# EAGLE design rfm69_carrier_leftside (EAGLE 7.1.0)
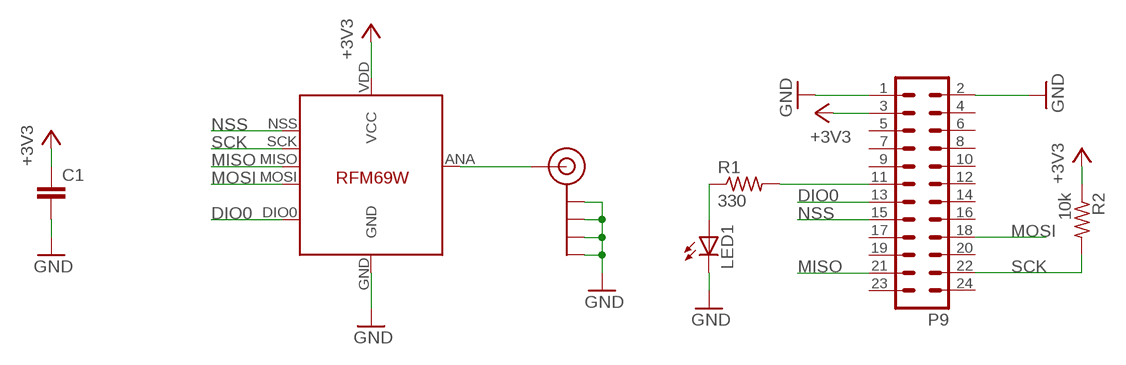
[diagram p0: schematic, sheet 1]

## Parts
ANT  SMA_EDGE  [SMA-EDGE]
C1  C-EUC1206  [C1206]
LED1  LEDCHIP-LED0805  [CHIP-LED0805]
P9  MA12-2W  [MA12-2W]
R1  330  R-US_R0603  [R0603]
R2  10k  R-US_R0603  [R0603]
U1  RFM69  [RFM69W-MINPADS]

## Nets
+3V3: C1.1 P9.3 R2.1 U1.VDD(VCC)
DIO0: P9.13 U1.DIO0
GND: ANT.GND@0(GND) ANT.GND@1(GND) ANT.GND@2(GND) ANT.GND@3(GND) C1.2 LED1.C P9.1 P9.2 U1.GND
MISO: P9.21 U1.MISO
MOSI: P9.18 U1.MOSI
N$1: ANT.SIG(SIGNAL) U1.ANA(ANT)
N$2: P9.11 R1.2
N$8: LED1.A R1.1
NSS: P9.15 U1.NSS(SEL)
SCK: P9.22 R2.2 U1.SCK
Unconnected: P9.4 P9.5 P9.6 P9.7 P9.8 P9.9 P9.10 P9.12 P9.14 P9.16 P9.17 P9.19 P9.20 P9.23 P9.24

## Library data of the parts
ANT = SparkFun-Connectors:SMA_EDGE: SMA Antenna Connector End launch SMA connector. The paste layer has been removed so that the connector can be hand soldered onto the board after reflow.
C1 = rcl:C-EU: CAPACITOR, European symbol
LED1 = led:LED: LED OSRAM: - CHIPLED LG R971, LG N971, LY N971, LG Q971, LY Q971, LO R971, LY R971 LH N974, LH R974 LS Q976, LO Q976, LY Q976 LO Q996 - Hyper CHIPLED LW Q18S LB Q993, LB Q99A, LB R99A - SideLED LS A670, LO A670, LY A670, LG A670, LP A670 LB A673, LV A673, LT A673, LW A673 LH A674 LY A675 LS A676, LA A676, LO A676, LY A676, LW A676 LS A679, LY A679, LG A679 - Hyper Micro SIDELED® LS Y876, LA Y876, LO Y876, LY Y876 LT Y87S - SmartLED LW L88C, LW L88S LB L89C, LB L89S, LG L890 LS L89K, LO L89K, LY L89K LS L896, LA L896, LO L896, LY L896 - TOPLED LS T670, LO T670, LY T670, LG T670, LP T670 LSG T670, LSP T670, LSY T670, LOP T670, LYG T670 LG T671, LOG T671, LSG T671 LB T673, LV T673, LT T673, LW T673 LH T674 LS T676, LA T676, LO T676, LY T676, LB T676, LH T676, LSB T676, LW T676 LB T67C, LV T67C, LT T67C, LS T67K, LO T67K, LY T67K, LW E67C LS E67B, LA E67B, LO E67B, LY E67B, LB E67C, LV E67C, LT E67C LW T67C LS T679, LY T679, LG T679 LS T770, LO T770, LY T770, LG T770, LP T770 LB T773, LV T773, LT T773, LW T773 LH T774 LS E675, LA E675, LY E675, LS T675 LS T776, LA T776, LO T776, LY T776, LB T776 LHGB T686 LT T68C, LB T68C - Hyper Mini TOPLED® LB M676 - Mini TOPLED Santana® LG M470 LS M47K, LO M47K, LY M47K Source: http://www.osram.convergy.de LUXEON: - LUMILED® LXK2-PW12-R00, LXK2-PW12-S00, LXK2-PW14-U00, LXK2-PW14-V00 LXK2-PM12-R00, LXK2-PM12-S00, LXK2-PM14-U00 LXK2-PE12-Q00, LXK2-PE12-R00, LXK2-PE12-S00, LXK2-PE14-T00, LXK2-PE14-U00 LXK2-PB12-K00, LXK2-PB12-L00, LXK2-PB12-M00, LXK2-PB14-N00, LXK2-PB14-P00, LXK2-PB14-Q00 LXK2-PR12-L00, LXK2-PR12-M00, LXK2-PR14-Q00, LXK2-PR14-R00 LXK2-PD12-Q00, LXK2-PD12-R00, LXK2-PD12-S00 LXK2-PH12-R00, LXK2-PH12-S00 LXK2-PL12-P00, LXK2-PL12-Q00, LXK2-PL12-R00 Source: www.luxeon.com KINGBRIGHT: KA-3528ASYC Source: www.kingbright.com
P9 = con-lstb:MA12-2W: PIN HEADER; OC_FARNELL: unknown; OC_NEWARK: unknown
R1 R2 = rcl:R-US_: RESISTOR, American symbol
U1 = LowPowerLab:RFM69

## Board
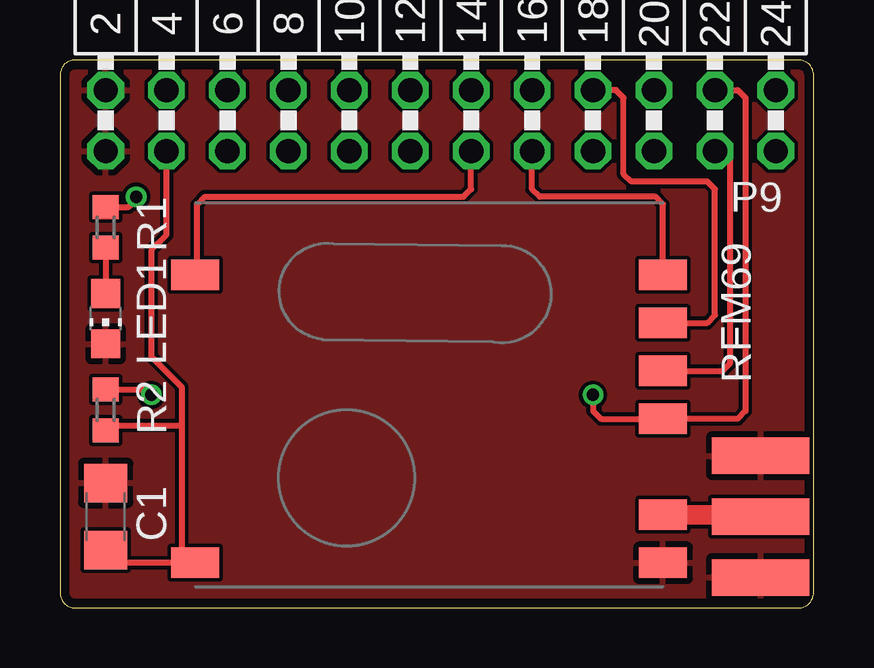
[diagram p1: board, top side]
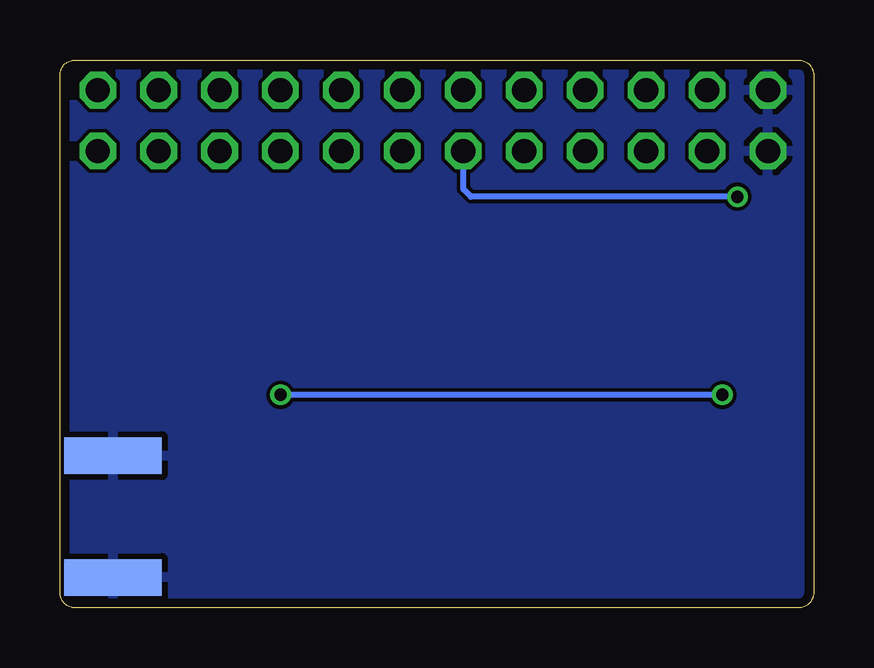
[diagram p2: board, bottom side, seen from below]

Size 31.42 x 22.85 mm. Coordinates in mm from the lower left corner, seen from the top.
Outline: 30.79,22.85 0.64,22.85 arc90 0,22.21 0,0.64 arc90 0.64,0 30.79,0 arc90 31.42,0.64 31.42,22.21 arc90 30.79,22.85
Copper layers (1*16): Top 0.0356mm / dielectric 1.5011mm / Bottom 0.0356mm
Design rules "LaenPCBOrder *": minimum track width 6mil, minimum drill 13mil, track to track 6mil, track to pad 6mil, pad to pad 6mil, via to via 6mil, smd to smd 6mil, copper to edge 15mil, drill to drill 6mil, minimum pad ring 7mil, minimum via ring 7mil, stop-mask expansion 3mil, vias tented up to drill 21mil, thermal gap 10mil

### Footprints (pad centres in the part's own frame; a part is rotated, then mirrored left to right if it is on the bottom)
SMA-EDGE = smd 1.524 x 4.064: GND@0 0,0; GND@1 5.08,0; SIG 2.54,0 | smd 1.524 x 4.064 bottom: GND@2 0,0; GND@3 5.08,0
C1206 = smd 1.6 x 1.8: 1 -1.4,0; 2 1.4,0
CHIP-LED0805 = smd 1.2 x 1.2: A 0,-1.05; C 0,1.05
MA12-2W = drill 1.016 octagon: 1 -13.97,-1.27; 2 -13.97,1.27; 3 -11.43,-1.27; 4 -11.43,1.27; 5 -8.89,-1.27; 6 -8.89,1.27; 7 -6.35,-1.27; 8 -6.35,1.27; 9 -3.81,-1.27; 10 -3.81,1.27; 11 -1.27,-1.27; 12 -1.27,1.27; 13 1.27,-1.27; 14 1.27,1.27; 15 3.81,-1.27; 16 3.81,1.27; 17 6.35,-1.27; 18 6.35,1.27; 19 8.89,-1.27; 20 8.89,1.27; 21 11.43,-1.27; 22 11.43,1.27; 23 13.97,-1.27; 24 13.97,1.27
R0603 = smd 1 x 1.1: 1 -0.85,0; 2 0.85,0
RFM69W-MINPADS = smd 2 x 1.27: ANA 8,-5; DIO0 -11.5,5; GND 8,-7; MISO 8,1; MOSI 8,3; NSS 8,5; SCK 8,-1; VDD -11.5,-7

### Placement (x,y rotation side)
ANT  29.21,6.35 270 top
C1  1.91,3.81 90 top
LED1  1.91,12.06 180 top
P9  15.88,20.32 0 top
R1  1.91,15.88 90 top
R2  1.91,8.26 90 top
U1  17.14,8.89 0 top

### Tracks (layer width: path | path; a pad name or v marks a point on that pad's centre or on a via)
+3V3
  Top 0.254: 5.71,1.89 U1.VDD 5.08,1.89 | P9.3 4.45,15.56 3.81,14.92 3.81,10.48 5.08,9.21 5.08,7.62 | 5.08,1.89 2.22,1.89 1.91,2.21 C1.1 | R2.1 1.91,7.62 5.08,7.62 | 5.08,7.62 5.08,1.89
DIO0
  Top 0.254: U1.DIO0 5.71,13.89 5.71,16.83 6.03,17.14 16.83,17.14 17.14,17.46 P9.13
GND
  pour Bottom: 0,0 31.75,0 31.75,22.86 0,22.86
  pour Top: 0,0 31.75,0 31.75,22.86 0,22.86
MISO
  Top 0.254: U1.MISO 27.62,9.89 27.94,10.21 27.94,19.05 P9.21
MOSI
  Top 0.254: U1.MOSI 26.99,11.89 27.3,12.21 27.3,17.46 26.99,17.78 23.81,17.78 23.5,18.1 23.5,21.27 23.18,21.59 P9.18
N$1
  Top 0.406: 29.84,3.89 ANT.SIG
  Top 0.813: U1.ANA 29.84,3.89
N$2  (via drill 0.51)
  Top 0.254: R1.2 2.86,16.73 3.17,17.04 v3.17,17.14
  Bottom 0.254: v3.17,17.14 14.29,17.14 14.61,17.46 P9.11
N$8
  Top 0.254: R1.1 LED1.A
NSS
  Top 0.254: U1.NSS 25.14,16.83 24.83,17.14 20,17.14 19.68,17.46 P9.15
SCK  (via drill 0.51)
  Top 0.254: P9.22 28.26,21.59 28.57,21.27 28.57,8.21 28.26,7.89 U1.SCK 22.54,7.89 22.23,8.21 v22.23,8.89 | R2.2 3.81,9.11 v3.81,8.89
  Bottom 0.254: v3.81,8.89 v22.23,8.89